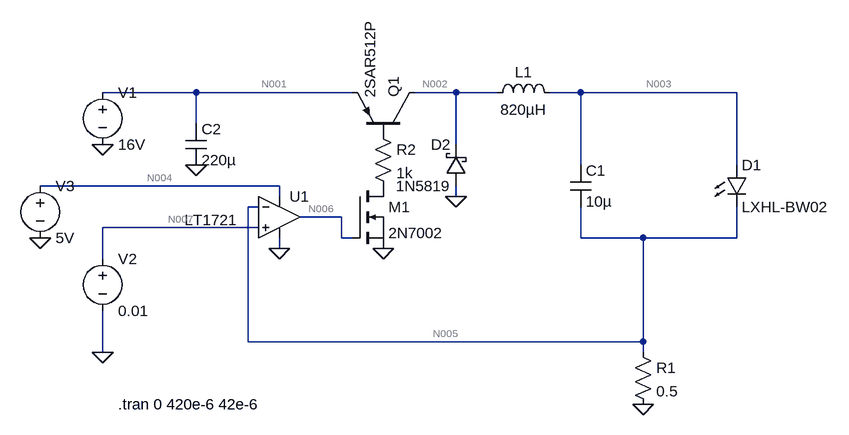
[diagram p0: schematic Draft2.asc]
Draft2.asc, the LTspice schematic file:
Version 4
SHEET 1 1044 680
WIRE 48 -16 -96 -16
WIRE 288 -16 48 -16
WIRE 448 -16 384 -16
WIRE 512 -16 448 -16
WIRE 640 -16 592 -16
WIRE 880 -16 640 -16
WIRE 48 32 48 -16
WIRE 448 64 448 -16
WIRE 640 96 640 -16
WIRE 880 96 880 -16
WIRE 176 128 -192 128
WIRE 176 144 176 128
WIRE 448 144 448 128
WIRE 144 160 128 160
WIRE 272 176 208 176
WIRE 144 192 -96 192
WIRE 272 208 272 176
WIRE 288 208 272 208
WIRE 640 208 640 160
WIRE 736 208 640 208
WIRE 880 208 880 160
WIRE 880 208 736 208
WIRE 176 224 176 208
WIRE -96 240 -96 192
WIRE 128 368 128 160
WIRE 736 368 736 208
WIRE 736 368 128 368
WIRE -96 384 -96 320
WIRE 736 384 736 368
FLAG -96 64 0
FLAG -96 384 0
FLAG 736 464 0
FLAG 48 96 0
FLAG 448 144 0
FLAG 176 224 0
FLAG -192 208 0
FLAG 336 224 0
SYMBOL voltage -96 -32 R0
WINDOW 123 0 0 Left 2
WINDOW 39 0 0 Left 2
SYMATTR InstName V1
SYMATTR Value 16V
SYMBOL voltage -96 224 R0
WINDOW 123 0 0 Left 2
WINDOW 39 0 0 Left 2
SYMATTR InstName V2
SYMATTR Value 0.01
SYMBOL Comparators\\LT1721 176 112 R0
WINDOW 3 -146 68 Left 2
SYMATTR InstName U1
SYMBOL LED 864 96 R0
SYMATTR InstName D1
SYMATTR Value LXHL-BW02
SYMBOL pnp 384 48 M270
SYMATTR InstName Q1
SYMATTR Value 2SAR512P
SYMBOL ind 496 0 R270
WINDOW 0 32 56 VTop 2
WINDOW 3 5 56 VBottom 2
SYMATTR InstName L1
SYMATTR Value 820µH
SYMBOL schottky 464 128 R180
WINDOW 0 24 64 Left 2
WINDOW 3 24 0 Left 2
SYMATTR InstName D2
SYMATTR Value 1N5819
SYMBOL res 720 368 R0
SYMATTR InstName R1
SYMATTR Value 0.5
SYMBOL cap 624 96 R0
SYMATTR InstName C1
SYMATTR Value 10µ
SYMBOL res 320 32 R0
SYMATTR InstName R2
SYMATTR Value 1k
SYMBOL cap 32 32 R0
SYMATTR InstName C2
SYMATTR Value 220µ
SYMBOL voltage -192 112 R0
WINDOW 123 0 0 Left 2
WINDOW 39 0 0 Left 2
SYMATTR InstName V3
SYMATTR Value 5V
SYMBOL nmos 288 128 R0
SYMATTR InstName M1
SYMATTR Value 2N7002
TEXT -72 464 Left 2 !.tran 0 420e-6 42e-6

The netlist it stands for:
* Draft2.asc
V1 N001 0 16V
V2 N007 0 0.01
XU1 N007 N005 N004 0 N006 LT1720  ; LT1721, pins In+ In- V+ V- OUT
D1 N003 N005 LXHL-BW02
Q1 N002 P001 N001 0 2SAR512P
L1 N002 N003 820µH
D2 0 N002 1N5819
R1 N005 0 0.5
C1 N003 N005 10µ
R2 P001 P002 1k
C2 N001 0 220µ
V3 N004 0 5V
M1 P002 N006 0 0 2N7002
.model D D
.lib standard.dio
.model NPN NPN
.model PNP PNP
.lib standard.bjt
.model NMOS NMOS
.model PMOS PMOS
.lib standard.mos
.tran 0 420e-6 42e-6
.lib LTC.lib
.backanno
.end

* Results of the author's LTspice run, read from the files saved beside the schematic
* Operating Point, zero values left out:
*   V(n001) = 16 V
*   V(n007) = 10 mV
*   V(n005) = 9.988 mV
*   V(n004) = 5 V
*   V(n006) = 1.623 V
*   V(n003) = 2.76 V
*   V(n002) = 2.76 V
*   V(p001) = 15.36 V
*   V(p002) = 15.32 V
*   Ic(Q1) = -20.01 mA
*   Ib(Q1) = -43.55 µA
*   Ie(Q1) = 20.05 mA
*   Id(M1) = 43.55 µA
*   Is(M1) = -43.55 µA
*   I(D2) = -31.7 µA
*   I(D1) = 19.97 mA
*   I(L1) = 19.97 mA
*   I(R2) = 43.55 µA
*   I(R1) = 19.98 mA
*   I(V3) = -3.999 mA
*   I(V2) = 2.5 µA
*   I(V1) = -20.05 mA
*   Ix(u1:1) = -2.5 µA
*   Ix(u1:2) = -2.501 µA
*   Ix(u1:3) = 3.999 mA
*   Ix(u1:4) = -3.994 mA
*   Ix(u1:5) = 1.746 pA
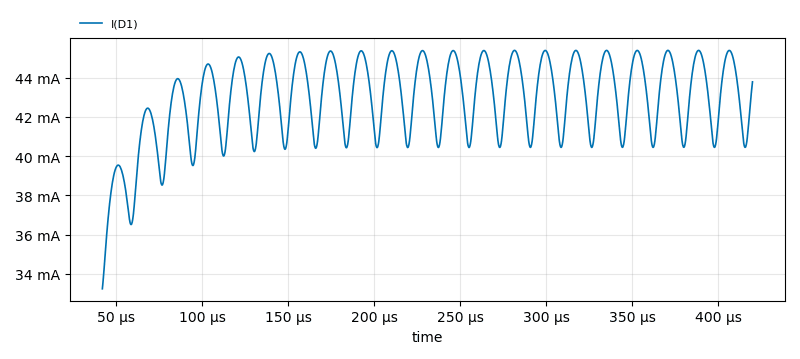
[diagram p1: Transient Analysis of Draft2.asc, plotted from the saved traces]
* Transient Analysis, 1 run:
*   I(D1): min 33.24 mA, max 45.38 mA, average 42.84 mA, rms 42.9 mA, last 43.78 mA